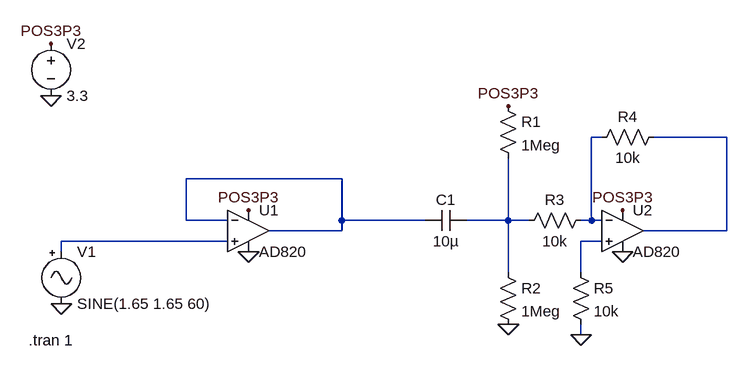
[diagram p0: schematic Draft1.asc]
Draft1.asc, the LTspice schematic file:
Version 4
SHEET 1 900 680
WIRE 704 32 688 32
WIRE 896 32 784 32
WIRE 304 96 64 96
WIRE 64 160 64 96
WIRE 128 160 64 160
WIRE 304 160 304 96
WIRE 432 160 304 160
WIRE 560 160 560 64
WIRE 560 160 496 160
WIRE 592 160 560 160
WIRE 688 160 688 32
WIRE 688 160 672 160
WIRE 704 160 688 160
WIRE 304 176 304 160
WIRE 304 176 192 176
WIRE 896 176 896 32
WIRE 896 176 768 176
WIRE 128 192 -128 192
WIRE 704 192 672 192
WIRE -128 208 -128 192
WIRE 560 240 560 160
WIRE 672 240 672 192
WIRE 672 336 672 320
FLAG 736 208 0
FLAG 560 320 0
FLAG 160 208 0
FLAG -128 288 0
FLAG -144 -32 0
FLAG -144 -112 POS3P3
FLAG 160 144 POS3P3
FLAG 736 144 POS3P3
FLAG 560 -16 POS3P3
FLAG 672 336 0
SYMBOL res 544 -32 R0
SYMATTR InstName R1
SYMATTR Value 1Meg
SYMBOL res 544 224 R0
SYMATTR InstName R2
SYMATTR Value 1Meg
SYMBOL res 688 144 R90
WINDOW 0 0 56 VBottom 2
WINDOW 3 32 56 VTop 2
SYMATTR InstName R3
SYMATTR Value 10k
SYMBOL res 800 16 R90
WINDOW 0 0 56 VBottom 2
WINDOW 3 32 56 VTop 2
SYMATTR InstName R4
SYMATTR Value 10k
SYMBOL Misc\\signal -128 192 R0
WINDOW 123 0 0 Left 2
WINDOW 39 0 0 Left 2
SYMATTR InstName V1
SYMATTR Value SINE(1.65 1.65 60)
SYMBOL voltage -144 -128 R0
SYMATTR InstName V2
SYMATTR Value 3.3
SYMBOL Opamps\\AD820 160 112 R0
SYMATTR InstName U1
SYMBOL Opamps\\AD820 736 112 R0
SYMATTR InstName U2
SYMBOL cap 496 144 R90
WINDOW 0 0 32 VBottom 2
WINDOW 3 32 32 VTop 2
SYMATTR InstName C1
SYMATTR Value 10µ
SYMBOL res 656 224 R0
SYMATTR InstName R5
SYMATTR Value 10k
TEXT -178 344 Left 2 !.tran 1

The netlist it stands for:
* Draft1.asc
R1 POS3P3 N004 1Meg
R2 N004 0 1Meg
R3 N001 N004 10k
R4 N002 N001 10k
V1 N005 0 SINE(1.65 1.65 60)
V2 POS3P3 0 3.3
XU1 N005 N003 POS3P3 0 N003 AD820  ; pins In+ In- V+ V- OUT
XU2 N006 N001 POS3P3 0 N002 AD820  ; pins In+ In- V+ V- OUT
C1 N004 N003 10µ
R5 N006 0 10k
.tran 1
.backanno
.end